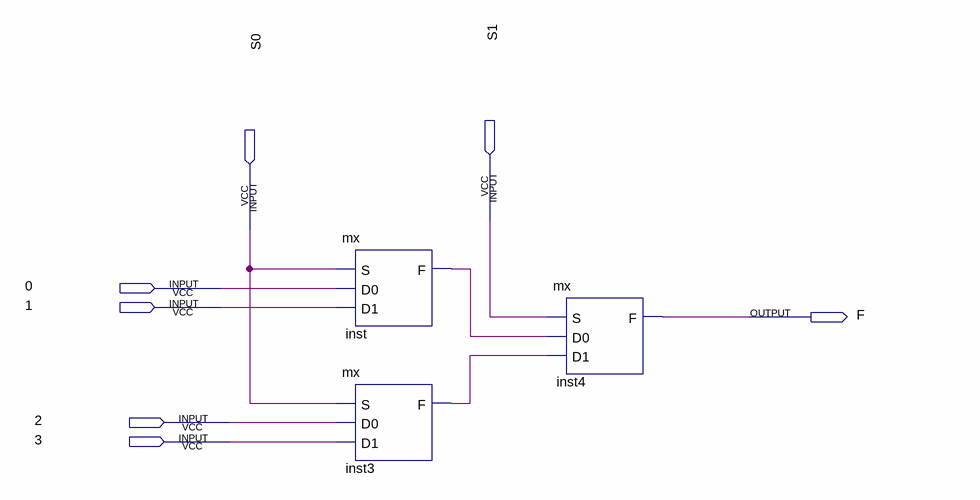
[diagram p0: schematic sheet]
// Quartus schematic mux4.bdf as structural Verilog: 3 symbols, 7 pins
module mux4 (
  input  S1,
  input  S0,
  input  \0 ,
  input  \1 ,
  input  \2 ,
  input  \3 ,
  output F
);

  wire inst3_f, inst_f;

  mx inst (.S(S0), .D0(\0 ), .D1(\1 ), .F(inst_f));
  mx inst3 (.S(S0), .D0(\2 ), .D1(\3 ), .F(inst3_f));
  mx inst4 (.S(S1), .D0(inst_f), .D1(inst3_f), .F(F));
endmodule
